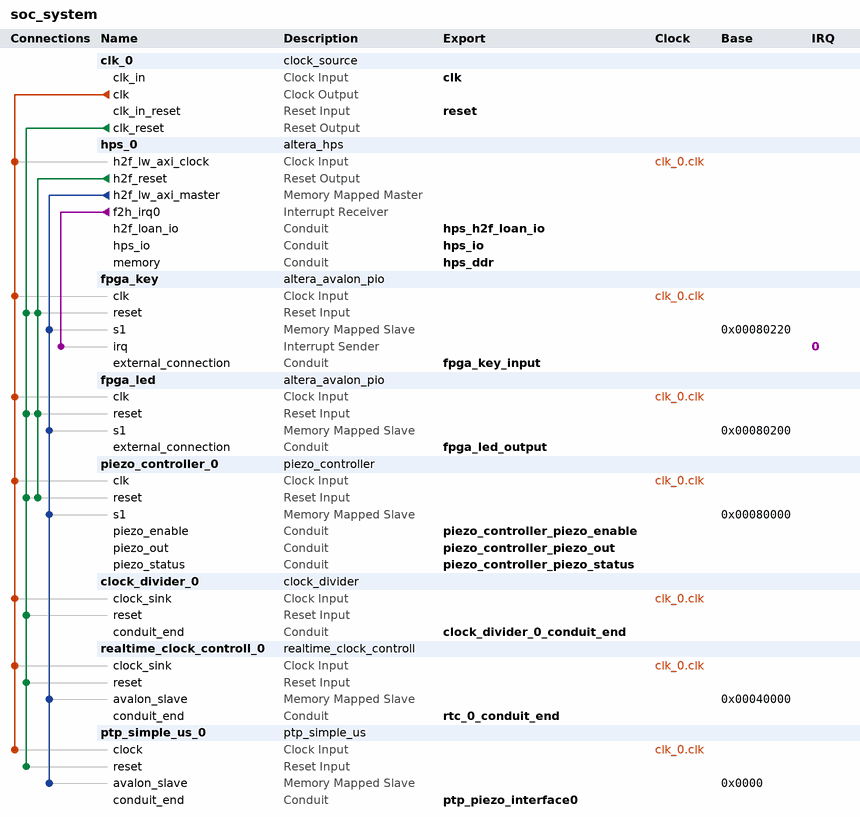
[diagram p0: system contents]
# Platform Designer (Qsys) system soc_system, Cyclone V 5CSEMA4U23C6
# Parameters at their usual value, and those the tool derives, are not listed.
package require -exact qsys 18.0
create_system soc_system
set_project_property DEVICE_FAMILY {Cyclone V}
set_project_property DEVICE 5CSEMA4U23C6

add_instance clk_0 clock_source 18.0
set_instance_parameter_value clk_0 clockFrequency 50000000

add_instance hps_0 altera_hps 18.0
set_instance_parameter_value hps_0 EMAC1_Mode RGMII
set_instance_parameter_value hps_0 EMAC1_PinMuxing {HPS I/O Set 0}
set_instance_parameter_value hps_0 F2SCLK_COLDRST_Enable false
set_instance_parameter_value hps_0 F2SCLK_DBGRST_Enable false
set_instance_parameter_value hps_0 F2SCLK_WARMRST_Enable false
set_instance_parameter_value hps_0 F2SINTERRUPT_Enable true
set_instance_parameter_value hps_0 F2S_Width 0
set_instance_parameter_value hps_0 FPGA_PERIPHERAL_OUTPUT_CLOCK_FREQ_EMAC0_GTX_CLK 125
set_instance_parameter_value hps_0 FPGA_PERIPHERAL_OUTPUT_CLOCK_FREQ_EMAC0_MD_CLK 2.5
set_instance_parameter_value hps_0 FPGA_PERIPHERAL_OUTPUT_CLOCK_FREQ_EMAC1_GTX_CLK 125
set_instance_parameter_value hps_0 FPGA_PERIPHERAL_OUTPUT_CLOCK_FREQ_EMAC1_MD_CLK 2.5
set_instance_parameter_value hps_0 HPS_PROTOCOL DDR3
set_instance_parameter_value hps_0 I2C0_Mode I2C
set_instance_parameter_value hps_0 I2C0_PinMuxing {HPS I/O Set 0}
set_instance_parameter_value hps_0 I2C1_Mode N/A
set_instance_parameter_value hps_0 I2C1_PinMuxing Unused
set_instance_parameter_value hps_0 LWH2F_Enable true
set_instance_parameter_value hps_0 MEM_BANKADDR_WIDTH 3
set_instance_parameter_value hps_0 MEM_CLK_FREQ 400.0
set_instance_parameter_value hps_0 MEM_COL_ADDR_WIDTH 10
set_instance_parameter_value hps_0 MEM_DQ_WIDTH 32
set_instance_parameter_value hps_0 MEM_DRV_STR RZQ/6
set_instance_parameter_value hps_0 MEM_ROW_ADDR_WIDTH 15
set_instance_parameter_value hps_0 MEM_RTT_NOM RZQ/6
set_instance_parameter_value hps_0 MEM_RTT_WR {Dynamic ODT off}
set_instance_parameter_value hps_0 MEM_TCL 7
set_instance_parameter_value hps_0 MEM_TFAW_NS 37.5
set_instance_parameter_value hps_0 MEM_TRAS_NS 35.0
set_instance_parameter_value hps_0 MEM_TRCD_NS 13.75
set_instance_parameter_value hps_0 MEM_TRFC_NS 300.0
set_instance_parameter_value hps_0 MEM_TRP_NS 13.75
set_instance_parameter_value hps_0 MEM_VENDOR Other
set_instance_parameter_value hps_0 MEM_WTCL 7
set_instance_parameter_value hps_0 QSPI_Mode N/A
set_instance_parameter_value hps_0 QSPI_PinMuxing Unused
set_instance_parameter_value hps_0 REF_CLK_FREQ 25.0
set_instance_parameter_value hps_0 S2FCLK_USER2CLK 5
set_instance_parameter_value hps_0 S2F_Width 0
set_instance_parameter_value hps_0 SDIO_Mode {4-bit Data}
set_instance_parameter_value hps_0 SDIO_PinMuxing {HPS I/O Set 0}
set_instance_parameter_value hps_0 SPIM1_Mode N/A
set_instance_parameter_value hps_0 SPIM1_PinMuxing Unused
set_instance_parameter_value hps_0 STM_Enable false
set_instance_parameter_value hps_0 TIMING_BOARD_AC_SKEW 0.02
set_instance_parameter_value hps_0 TIMING_BOARD_AC_TO_CK_SKEW 0.0
set_instance_parameter_value hps_0 TIMING_BOARD_DQ_TO_DQS_SKEW 0.0
set_instance_parameter_value hps_0 TIMING_BOARD_MAX_CK_DELAY 0.6
set_instance_parameter_value hps_0 TIMING_BOARD_MAX_DQS_DELAY 0.6
set_instance_parameter_value hps_0 TIMING_BOARD_SKEW_BETWEEN_DQS 0.02
set_instance_parameter_value hps_0 TIMING_BOARD_SKEW_CKDQS_DIMM_MAX 0.01
set_instance_parameter_value hps_0 TIMING_BOARD_SKEW_CKDQS_DIMM_MIN -0.01
set_instance_parameter_value hps_0 TIMING_BOARD_SKEW_WITHIN_DQS 0.02
set_instance_parameter_value hps_0 TIMING_TDH 125
set_instance_parameter_value hps_0 TIMING_TDQSCK 400
set_instance_parameter_value hps_0 TIMING_TDQSQ 120
set_instance_parameter_value hps_0 TIMING_TDS 50
set_instance_parameter_value hps_0 TIMING_TIH 250
set_instance_parameter_value hps_0 TIMING_TIS 175
set_instance_parameter_value hps_0 TIMING_TQSH 0.38
set_instance_parameter_value hps_0 UART0_Mode {No Flow Control}
set_instance_parameter_value hps_0 UART0_PinMuxing {HPS I/O Set 0}
set_instance_parameter_value hps_0 USB1_Mode SDR
set_instance_parameter_value hps_0 USB1_PinMuxing {HPS I/O Set 0}
set_instance_parameter_value hps_0 desired_cfg_clk_mhz 100.0
set_instance_parameter_value hps_0 desired_qspi_clk_mhz 400.0

add_instance fpga_key altera_avalon_pio 18.0
set_instance_parameter_value fpga_key bitClearingEdgeCapReg true
set_instance_parameter_value fpga_key captureEdge true
set_instance_parameter_value fpga_key direction Input
set_instance_parameter_value fpga_key edgeType FALLING
set_instance_parameter_value fpga_key generateIRQ true
set_instance_parameter_value fpga_key irqType EDGE
set_instance_parameter_value fpga_key width 2

add_instance fpga_led altera_avalon_pio 18.0
set_instance_parameter_value fpga_led bitModifyingOutReg true
set_instance_parameter_value fpga_led direction Output
set_instance_parameter_value fpga_led width 8

add_instance piezo_controller_0 piezo_controller 1.0
set_instance_parameter_value piezo_controller_0 clock_rate 50000000
set_instance_parameter_value piezo_controller_0 piezo_count 61

add_instance clock_divider_0 clock_divider 1.0

add_instance realtime_clock_controll_0 realtime_clock_controll 1.0
set_instance_parameter_value realtime_clock_controll_0 CLOCK_SPEED_HZ 50000000
set_instance_parameter_value realtime_clock_controll_0 RTC_RESOLUTION 100

add_instance ptp_simple_us_0 ptp_simple_us 1.0

# connections
add_connection clk_0.clk clock_divider_0.clock_sink clock
add_connection clk_0.clk fpga_key.clk clock
add_connection clk_0.clk fpga_led.clk clock
add_connection clk_0.clk hps_0.h2f_lw_axi_clock clock
add_connection clk_0.clk piezo_controller_0.clk clock
add_connection clk_0.clk ptp_simple_us_0.clock clock
add_connection clk_0.clk realtime_clock_controll_0.clock_sink clock
add_connection clk_0.clk_reset clock_divider_0.reset reset
add_connection clk_0.clk_reset fpga_key.reset reset
add_connection clk_0.clk_reset fpga_led.reset reset
add_connection clk_0.clk_reset piezo_controller_0.reset reset
add_connection clk_0.clk_reset ptp_simple_us_0.reset reset
add_connection clk_0.clk_reset realtime_clock_controll_0.reset reset
add_connection hps_0.h2f_reset fpga_key.reset reset
add_connection hps_0.h2f_reset fpga_led.reset reset
add_connection hps_0.h2f_reset piezo_controller_0.reset reset
add_connection hps_0.h2f_lw_axi_master fpga_key.s1 avalon
set_connection_parameter_value hps_0.h2f_lw_axi_master/fpga_key.s1 baseAddress 0x00080220
add_connection hps_0.h2f_lw_axi_master fpga_led.s1 avalon
set_connection_parameter_value hps_0.h2f_lw_axi_master/fpga_led.s1 baseAddress 0x00080200
add_connection hps_0.h2f_lw_axi_master piezo_controller_0.s1 avalon
set_connection_parameter_value hps_0.h2f_lw_axi_master/piezo_controller_0.s1 baseAddress 0x00080000
add_connection hps_0.h2f_lw_axi_master ptp_simple_us_0.avalon_slave avalon
set_connection_parameter_value hps_0.h2f_lw_axi_master/ptp_simple_us_0.avalon_slave baseAddress 0x0000
add_connection hps_0.h2f_lw_axi_master realtime_clock_controll_0.avalon_slave avalon
set_connection_parameter_value hps_0.h2f_lw_axi_master/realtime_clock_controll_0.avalon_slave baseAddress 0x00040000
add_connection hps_0.f2h_irq0 fpga_key.irq interrupt
set_connection_parameter_value hps_0.f2h_irq0/fpga_key.irq irqNumber 0

# exported interfaces
add_interface clk clock sink
set_interface_property clk EXPORT_OF clk_0.clk_in
add_interface clock_divider_0_conduit_end conduit end
set_interface_property clock_divider_0_conduit_end EXPORT_OF clock_divider_0.conduit_end
add_interface fpga_key_input conduit end
set_interface_property fpga_key_input EXPORT_OF fpga_key.external_connection
add_interface fpga_led_output conduit end
set_interface_property fpga_led_output EXPORT_OF fpga_led.external_connection
add_interface hps_ddr conduit end
set_interface_property hps_ddr EXPORT_OF hps_0.memory
add_interface hps_h2f_loan_io conduit end
set_interface_property hps_h2f_loan_io EXPORT_OF hps_0.h2f_loan_io
add_interface hps_io conduit end
set_interface_property hps_io EXPORT_OF hps_0.hps_io
add_interface piezo_controller_piezo_enable conduit end
set_interface_property piezo_controller_piezo_enable EXPORT_OF piezo_controller_0.piezo_enable
add_interface piezo_controller_piezo_out conduit end
set_interface_property piezo_controller_piezo_out EXPORT_OF piezo_controller_0.piezo_out
add_interface piezo_controller_piezo_status conduit end
set_interface_property piezo_controller_piezo_status EXPORT_OF piezo_controller_0.piezo_status
add_interface ptp_piezo_interface0 conduit end
set_interface_property ptp_piezo_interface0 EXPORT_OF ptp_simple_us_0.conduit_end
add_interface reset reset sink
set_interface_property reset EXPORT_OF clk_0.clk_in_reset
add_interface rtc_0_conduit_end conduit end
set_interface_property rtc_0_conduit_end EXPORT_OF realtime_clock_controll_0.conduit_end

set_interconnect_requirement {$system} qsys_mm.clockCrossingAdapter HANDSHAKE
set_interconnect_requirement {$system} qsys_mm.enableEccProtection FALSE
set_interconnect_requirement {$system} qsys_mm.insertDefaultSlave FALSE
set_interconnect_requirement {$system} qsys_mm.maxAdditionalLatency 1

save_system soc_system.qsys
